# Altium project RasPower.PrjPcb
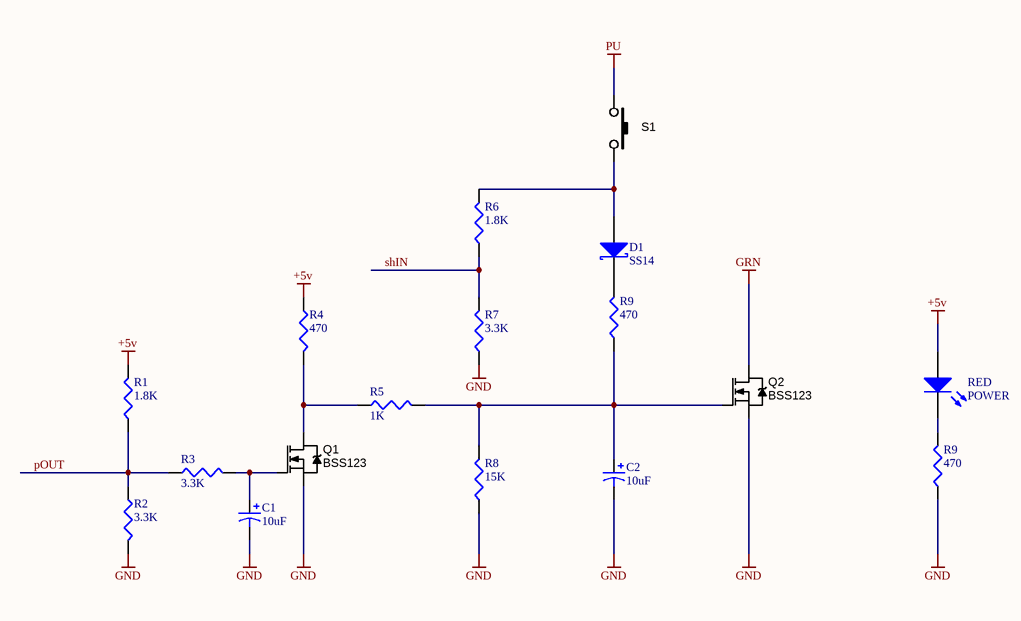
[diagram p0: ATX.SchDoc]
2 sheets, 36 parts. Net scope: global (net labels, ports and power ports of the same name join across sheets).
Sheets:
  ATX.SchDoc
  UPS.SchDoc

## Sheet ATX.SchDoc
size A4

### Parts
(Parts that share a designator on the sheet are numbered #1, #2 ... from top to bottom, then left to right.)
C1#1  value 10uF  [C0805]  (hidden comment: Cap Pol3)
C2#1  value 10uF  [C0805]  (hidden comment: Cap Pol3)
D1#1  SS14  [SMA]
Q1  BSS123  [SOT23-3]
Q2  BSS123  [SOT23-3]
R1#1  value 1.8K  [J1-0603]  (hidden comment: Res3)
R2#1  value 3.3K  [J1-0603]  (hidden comment: Res3)
R3#1  value 3.3K  [J1-0603]  (hidden comment: Res3)
R4#1  value 470  [J1-0603]  (hidden comment: Res3)
R5#1  value 1K  [J1-0603]  (hidden comment: Res3)
R6#1  value 1.8K  [J1-0603]  (hidden comment: Res3)
R7#1  value 3.3K  [J1-0603]  (hidden comment: Res3)
R8#1  value 15K  [J1-0603]  (hidden comment: Res3)
R9#1  value 470  [J1-0603]  (hidden comment: Res3)
R9#2  value 470  [J1-0603]  (hidden comment: Res3)
RED  POWER  [3.5X2.8X1.9]
S1  TS-1143S-WP  [TS-1143S]  (value not drawn)

### Nets
+5v: R1#1.2 R4#1.1 RED.1(A)
GND: C1#1.2 C2#1.2 Q1.2(S) Q2.2(S) R2#1.2 R7#1.1 R8#1.1 R9#2.1
GRN: Q2.3(D)
PU: S1.1
pOUT: R1#1.1 R2#1.1 R3#1.1
shIN: R6#1.1 R7#1.2
NetC1#1_1: C1#1.1 Q1.1(G) R3#1.2
NetC2#1_1: C2#1.1 Q2.1(G) R5#1.2 R8#1.2 R9#1.1
NetD1#1_1: D1#1.1(A) R6#1.2 S1.2
NetD1#1_2: D1#1.2(K) R9#1.2
NetQ1_3: Q1.3(D) R4#1.2 R5#1.1
NetR9#2_2: R9#2.2 RED.2(K)

### Library data of the parts
C1#1 C2#1 = Cap Pol3: Polarized Capacitor (Surface Mount); Published: 8-Jun-2000; LatestRevisionDate: 29-May-2009; LatestRevisionNote: IPC-7351 Footprint Added.; PackageReference: C0805; Publisher: Altium Limited; PackageDescription: Chip Capacitor
D1#1 = 10MQ060N: Schottky Rectifier; Published: 17-Sep-2003; DatasheetVersion: May-2002; PackageVersion: revH, May-2002; PackageReference: SMA; Publisher: Altium Limited; PackageDescription: DO-214-AC/SMA; 2 C-Bend Leads; Body 5 x 2.7 mm, inc. leads (LxW); ComponentLink1Description: Manufacturer Link; ComponentLink1URL: http://www.irf.com/; ComponentLink2Description: Datasheet; ComponentLink2URL: http://www.irf.com/product-info/datasheets/data/10MQ060N.pdf; Supplier Part Number 1: SS14-E3/61TGICT-ND; Supplier 1: Digi-Key
Q1 Q2 = MOSFET_BSS123: MOSFET SMD N-CH 100V 170mA SOT23-3; Manufacturer 1: Diodes Inc; Manufacturer Part Number 1: BSS123-7-F; Ratings: 100V; 170mA; Material: Metal Oxide; SCDType: source; Package / Case: SOT23-3; Supplier 1: Digi-Key; Supplier Part Number 1: BSS123-FDICT-ND
R1#1 R2#1 R3#1 R4#1 R5#1 R6#1 R7#1 R8#1 R9#1 R9#2 = Res3: Resistor; Published: 8-Jun-2000; LatestRevisionDate: 29-May-2009; LatestRevisionNote: IPC-7351 Footprint Added.; PackageReference: J1-0603; Publisher: Altium Limited; PackageDescription: Chip Resistor
RED = LED3: Typical BLUE SiC LED; Published: 8-Jun-2000; LatestRevisionDate: 17-Dec-2003; LatestRevisionNote: PCB Footprint replaced.; DatasheetVersion: 16-Apr-2002; PackageVersion: 16-Apr-2002; PackageReference: 3.5X2.8X1.9; Publisher: Altium Limited; PackageDescription: SM LED; 2 C-Bend Leads; Body 3.5 x 2.8 x 1.9 mm, inc leads (LxWxH typ); Supplier Part Number 1: 732-4995-1-ND; Supplier 1: Digi-Key
S1 = SW_SMD_PB_4.3mm: Switch SMD Tact 4.3mm Stem; Manufacturer 1: Bond-Tact; Manufacturer Part Number 1: TS-1143S-WP-200; SCDType: spec; Function: On/Off; Package / Case: 6.5x6.5mm; 4.3mm stem; Supplier Part Number 1: CKN10304CT-ND; Supplier 1: Digi-Key

## Sheet UPS.SchDoc
size A4
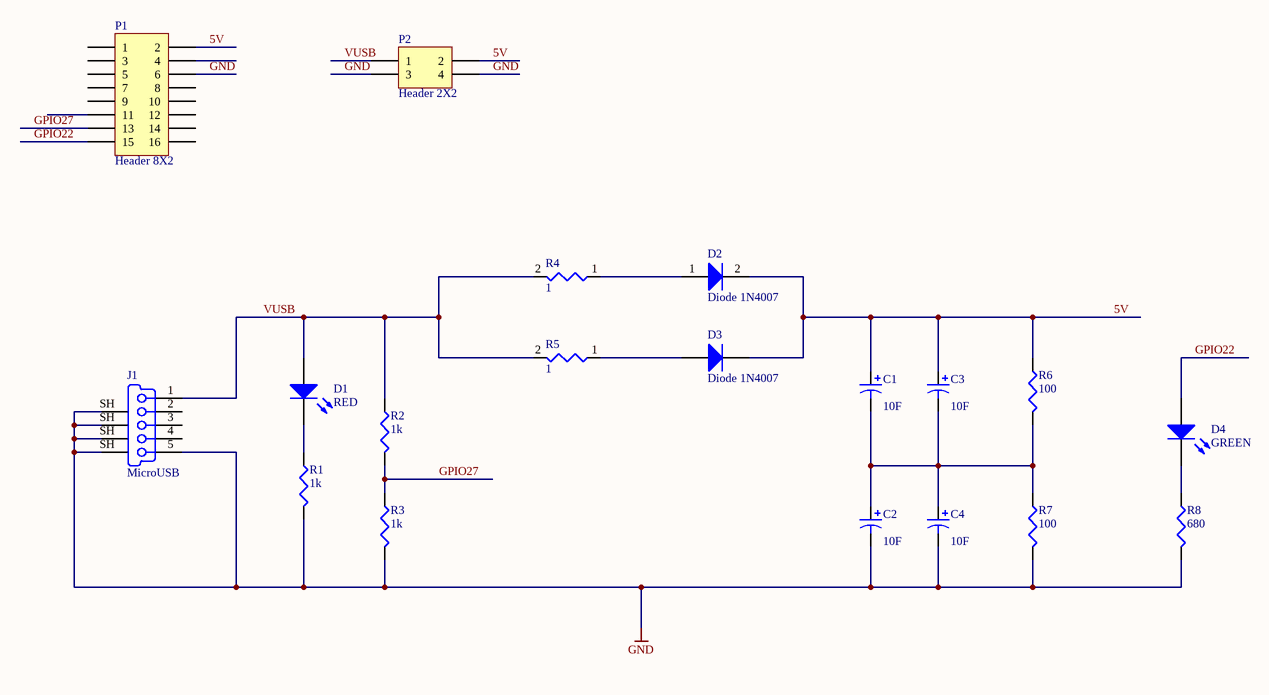
[diagram p1: UPS.SchDoc]

### Parts
(Parts that share a designator on the sheet are numbered #1, #2 ... from top to bottom, then left to right.)
C1#2  value 10F  [CAPE5.0mm]  (hidden comment: Cap Pol1)
C2#2  value 10F  [CAPE5.0mm]  (hidden comment: Cap Pol1)
C3  value 10F  [CAPE5.0mm]  (hidden comment: Cap Pol1)
C4  value 10F  [CAPE5.0mm]  (hidden comment: Cap Pol1)
D1#2  RED  [LED_3mm]
D2  Diode 1N4007  [DO-41]
D3  Diode 1N4007  [DO-41]
D4  GREEN  [LED_3mm]
J1  MicroUSB  [USB_Micro-B_FCI_SMD]
P1  Header 8X2  [HDR2X8]
P2  Header 2X2  [HDR2X2]
R1#2  value 1k  [RESTH_0.0R_AXIAL-0.6]  (hidden comment: Res3)
R2#2  value 1k  [RESTH_0.0R_AXIAL-0.6]  (hidden comment: Res3)
R3#2  value 1k  [RESTH_0.0R_AXIAL-0.6]  (hidden comment: Res3)
R4#2  value 1  [RESTH_AXIAL_MRA-12]  (hidden comment: Res3)
R5#2  value 1  [RESTH_AXIAL_MRA-12]  (hidden comment: Res3)
R6#2  value 100  [RESTH_0.0R_AXIAL-0.6]  (hidden comment: Res3)
R7#2  value 100  [RESTH_0.0R_AXIAL-0.6]  (hidden comment: Res3)
R8#2  value 680  [RESTH_0.0R_AXIAL-0.6]  (hidden comment: Res3)

### Nets
GND: C2#2.2 C4.2 J1.5(GND) J1.SH(Tab) P1.6 P2.3 P2.4 R1#2.2 R3#2.2 R7#2.2 R8#2.2
5V: C1#2.1 C3.1 D2.2 D3.2 P1.2 P2.2 R6#2.1
GPIO22: D4.1(A) P1.15
GPIO27: P1.13 R2#2.2 R3#2.1
VUSB: D1#2.1(A) J1.1(V_BUS_(5V)) P2.1 R2#2.1 R4#2.2 R5#2.2
NetC1#2_2: C1#2.2 C2#2.1 C3.2 C4.1 R6#2.2 R7#2.1
NetD1#2_2: D1#2.2(K) R1#2.1
NetD2_1: D2.1 R4#2.1
NetD3_1: D3.1 R5#2.1
NetD4_2: D4.2(K) R8#2.1

Not connected (* = marked no-connect by the designer): J1 2(D-) 3(D+) 4(NC); P1 1 3 4 5 7 8 9 10 11 12 14 16

### Library data of the parts
C1#2 C2#2 C3 C4 = Cap Pol1: Polarized Capacitor (Radial); Published: 8-Jun-2000; LatestRevisionDate: 17-Jul-2002; LatestRevisionNote: Re-released for DXP Platform.; PackageReference: RB7.6-15; Publisher: Altium Limited; PackageDescription: Polarized Capacitor (Radial); 2 Leads
D1#2 D4 = LED0: Typical INFRARED GaAs LED; pin to pad: 1>A 2>K; Published: 8-Jun-2000; LatestRevisionDate: 08-Jul-2005; LatestRevisionNote: Mech Layer 1 removed.; PackageReference: LED-0; Publisher: Altium Limited; PackageDescription: LED; 2 Leads
D2 D3 = Diode 1N4007: 1 Amp General Purpose Rectifier; pin to pad: 1>A 2>K; Published: 8-Jun-2000; LatestRevisionDate: 17-Jul-2002; LatestRevisionNote: Re-released for DXP Platform.; DatasheetVersion: 1998; PackageVersion: Aug-1999; PackageReference: DO-41; Publisher: Altium Limited; PackageDescription: Diode, Axial; Body 5.2 x 2.7 mm (LxDia. max), Lead Dia. 0.86 mm (max); Code_JEDEC: DO-204-AL; ComponentLink1Description: Manufacturer Link; ComponentLink1URL: http://www.fairchildsemi.com/; ComponentLink2Description: Datasheet; ComponentLink2URL: http://www.fairchildsemi.com/ds/1N%2F1N4001.pdf
J1 = MicroUSB: USB On-The-Go (OTG) Mini-B Receptacle, Right Angle, SMT, 0.80mm (.031") Pitch, Solder Tabs with Back Cover, Recessed Type; PCB_Layout: Complies with Manufacturer's Recommendation.; Published: 21-Sep-2007; DatasheetVersion: revA, May-2004; PackageVersion: May-2004; PackageReference: 481900001; Publisher: Altium Limited; PackageDescription: USB Mini-B, Sinking Type, SM; 5 Position; Right Angle, Body 11.45 x 11.8 x 3.9 mm (LxWxH); ComponentLink1Description: Manufacturer Link; ComponentLink1URL: http://www.molex.com/; ComponentLink2Description: Datasheet; ComponentLink2URL: http://www.molex.com/cmc_upload/0/000/895/958/SD-48190-001RevA.pdf
P1 = Header 8X2: Header, 8-Pin, Dual row; LatestRevisionDate: 17-Jul-2002; LatestRevisionNote: Re-released for DXP Platform.; Publisher: Altium Limited
P2 = Header 2X2: Header, 2-Pin, Dual row; LatestRevisionDate: 17-Jul-2002; LatestRevisionNote: Re-released for DXP Platform.; Publisher: Altium Limited
R1#2 R2#2 R3#2 R4#2 R5#2 R6#2 R7#2 R8#2 = Res3: Resistor; Published: 8-Jun-2000; LatestRevisionDate: 29-May-2009; LatestRevisionNote: IPC-7351 Footprint Added.; PackageReference: J1-0603; Publisher: Altium Limited; PackageDescription: Chip Resistor

## Nets that join several sheets
GND: ATX (8 pins), UPS (11 pins)